# Altium schematic sheet IPC_V3S.SchDoc
size A1
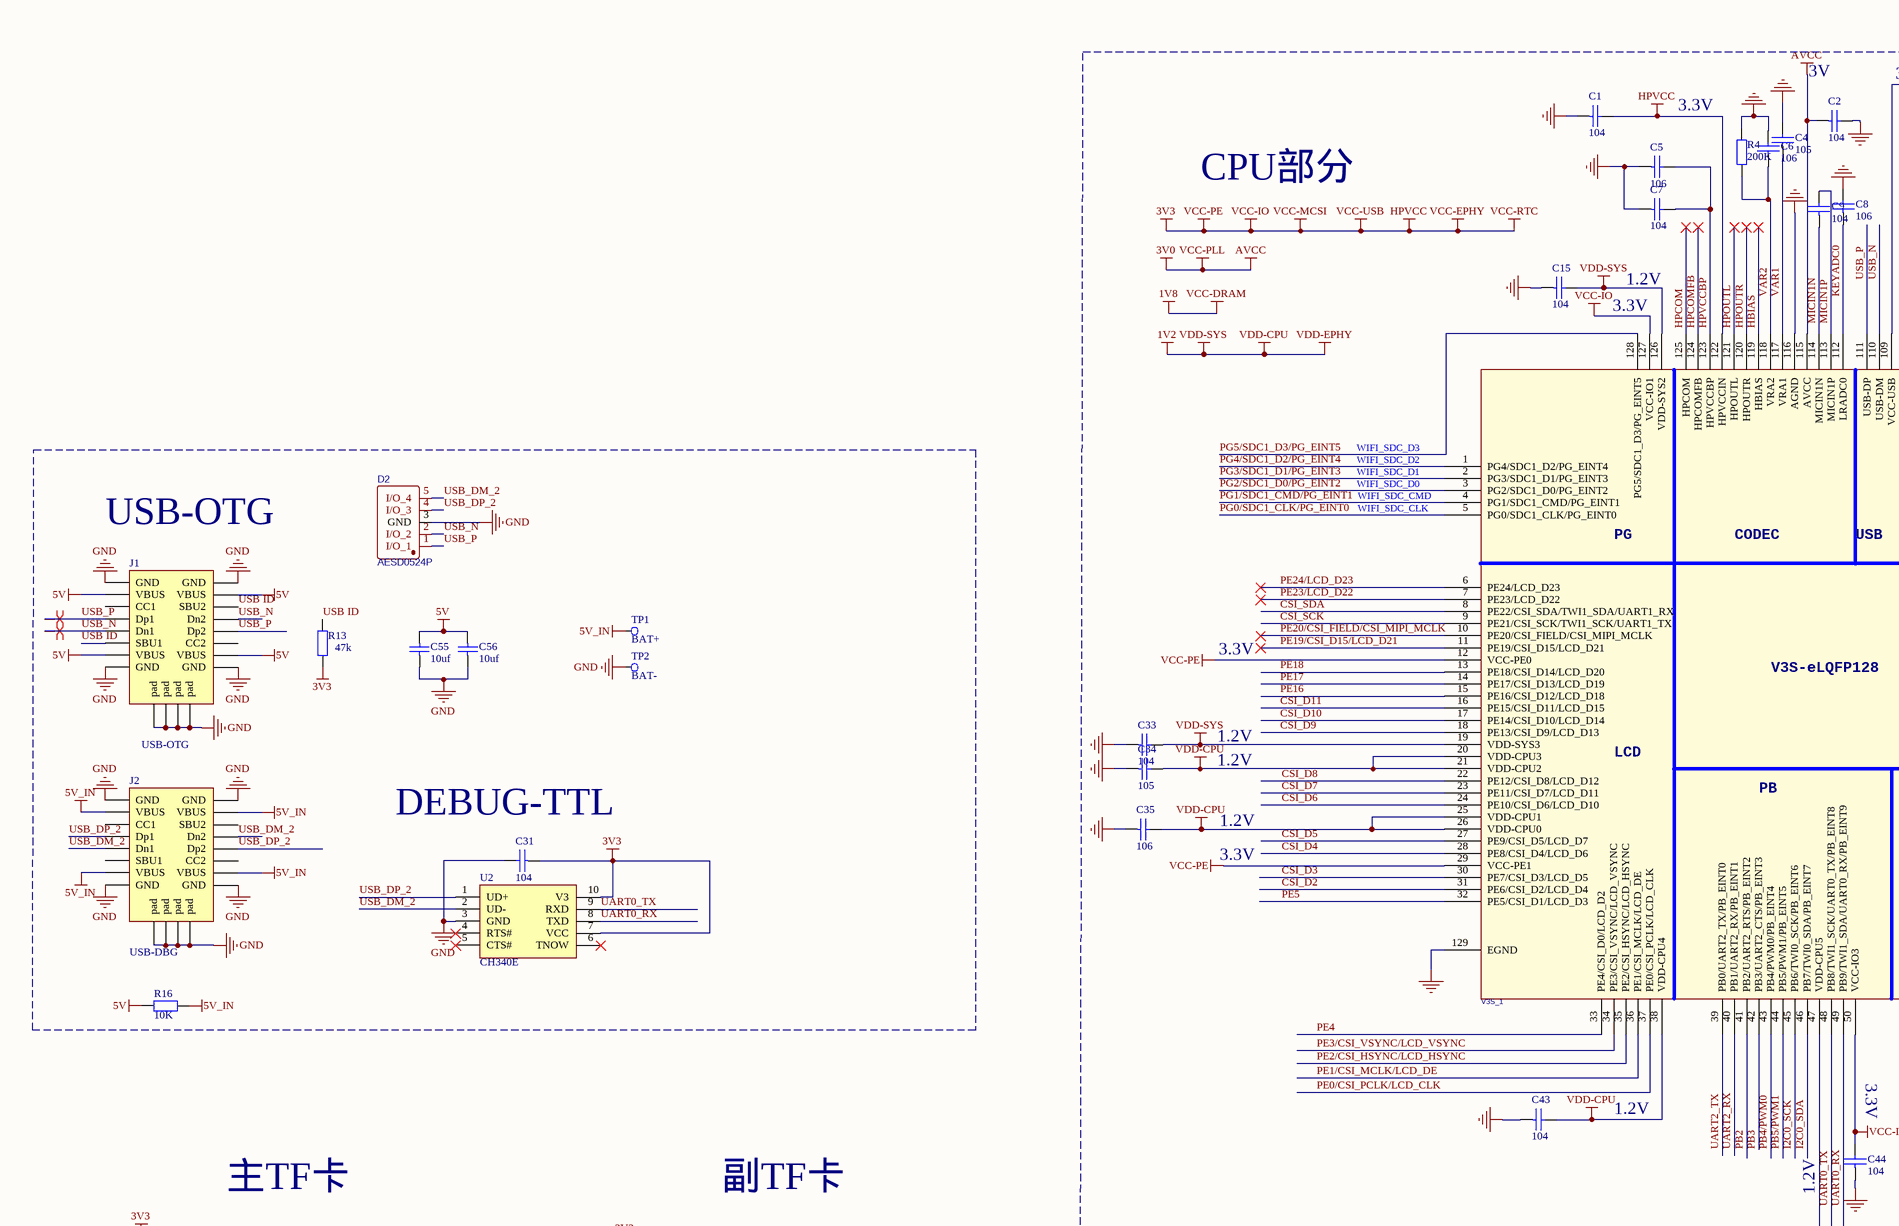
[diagram p0: IPC_V3S.SchDoc, top left]
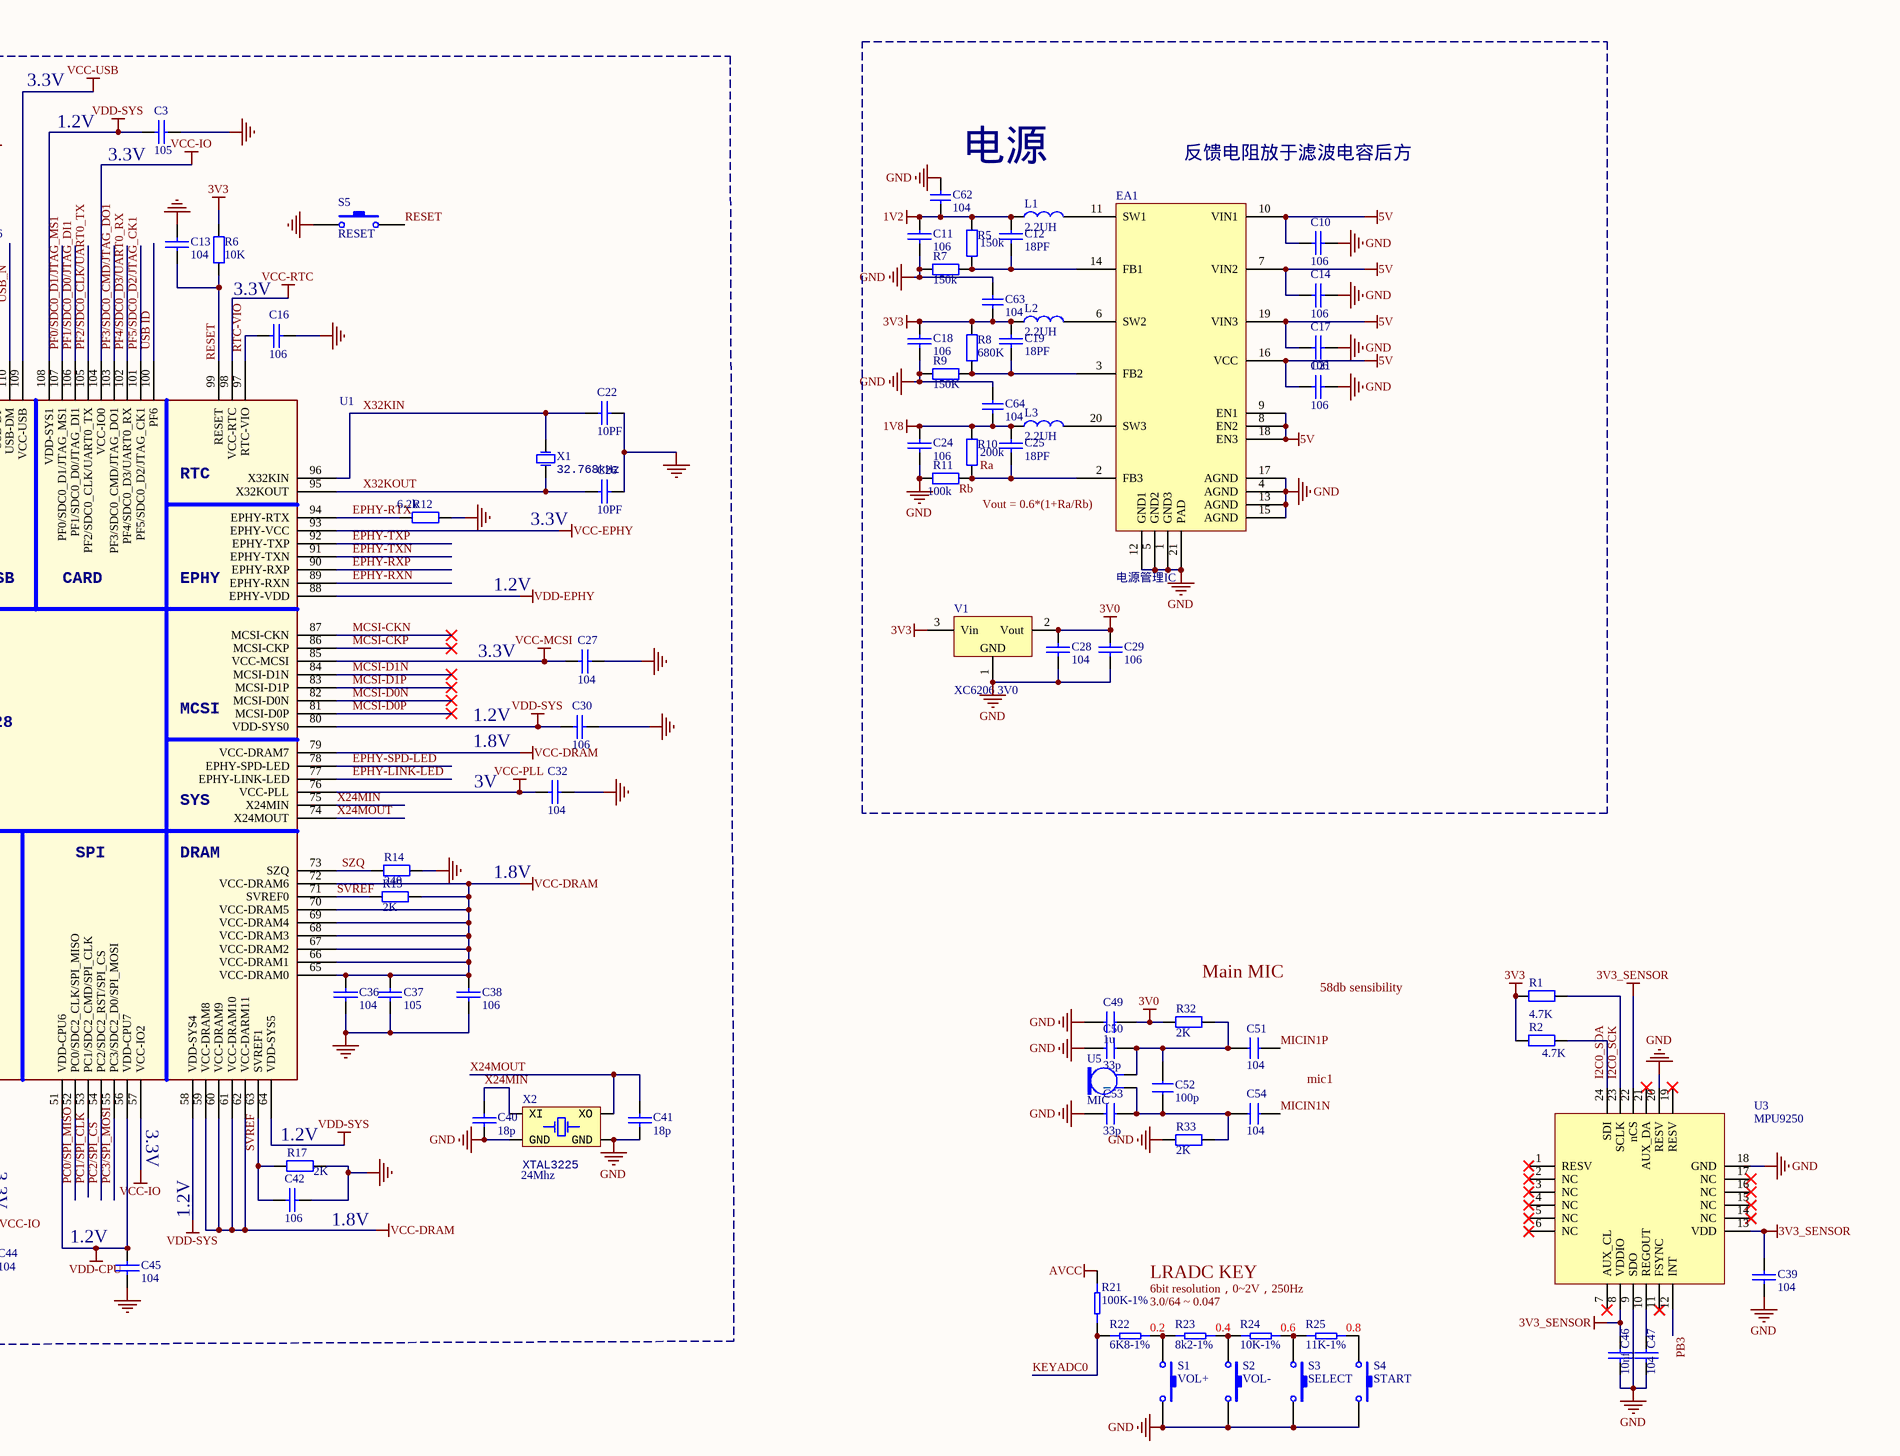
[diagram p1: IPC_V3S.SchDoc, top right]
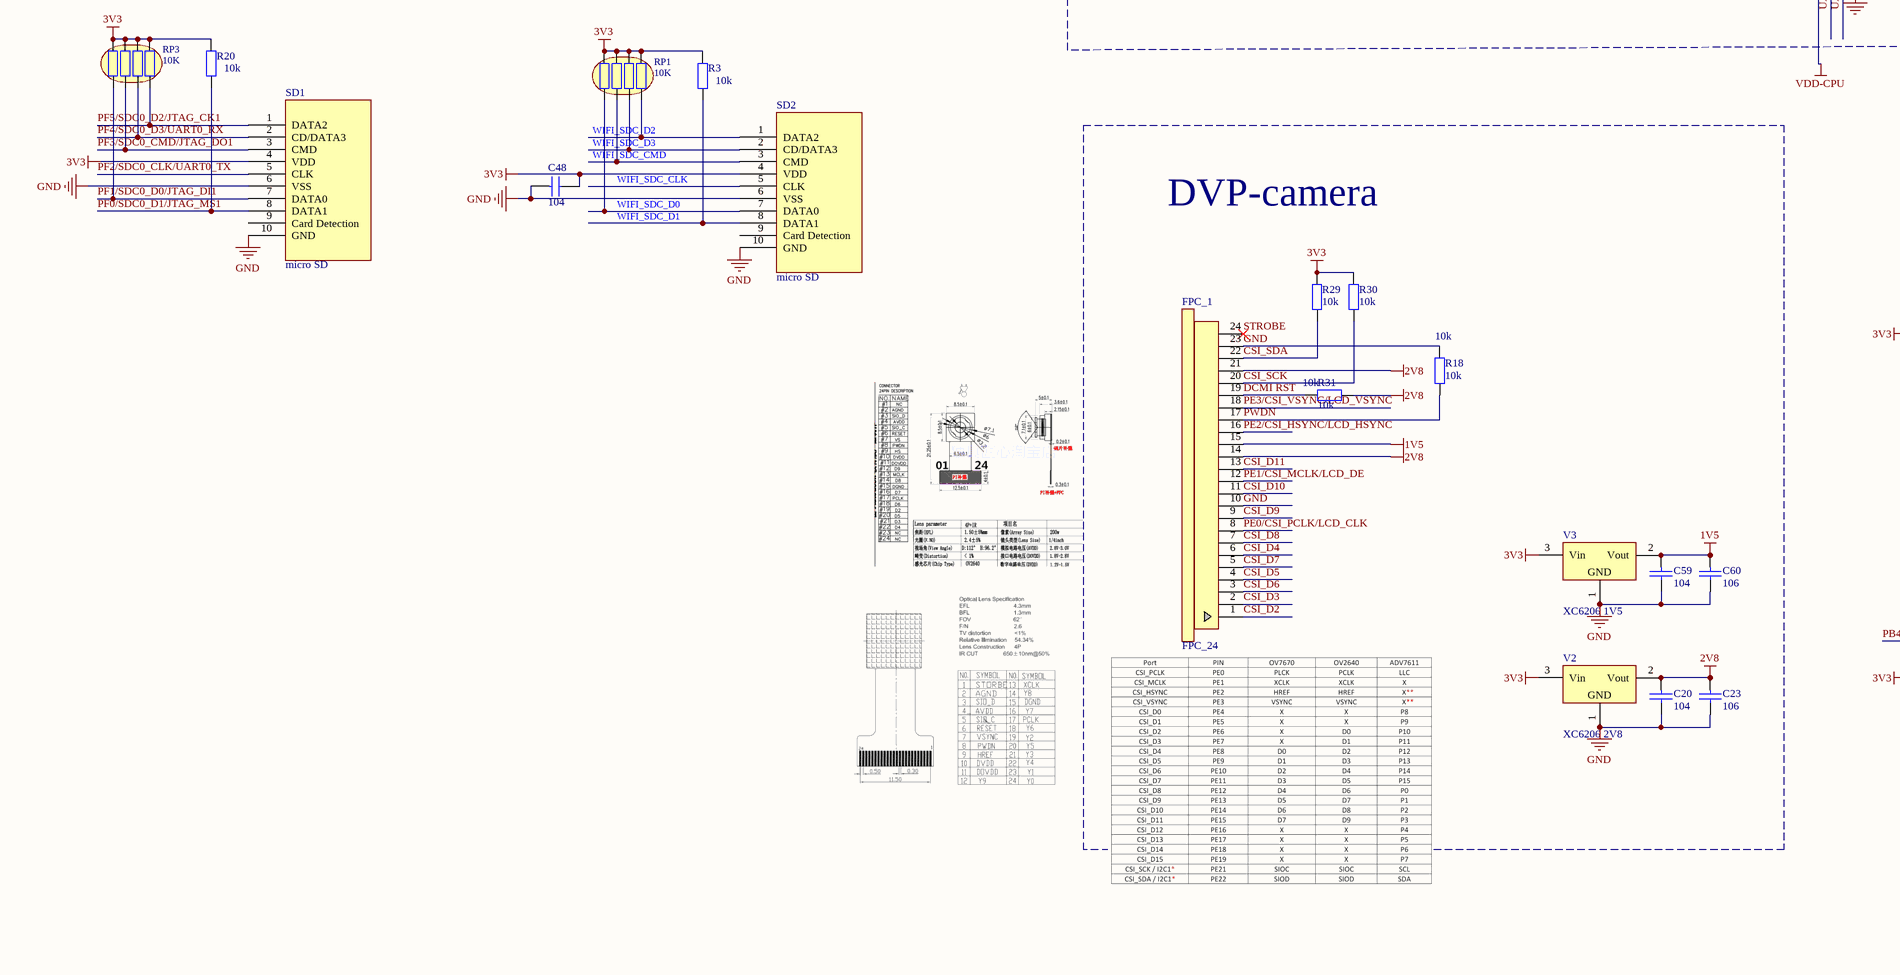
[diagram p2: IPC_V3S.SchDoc, bottom left]
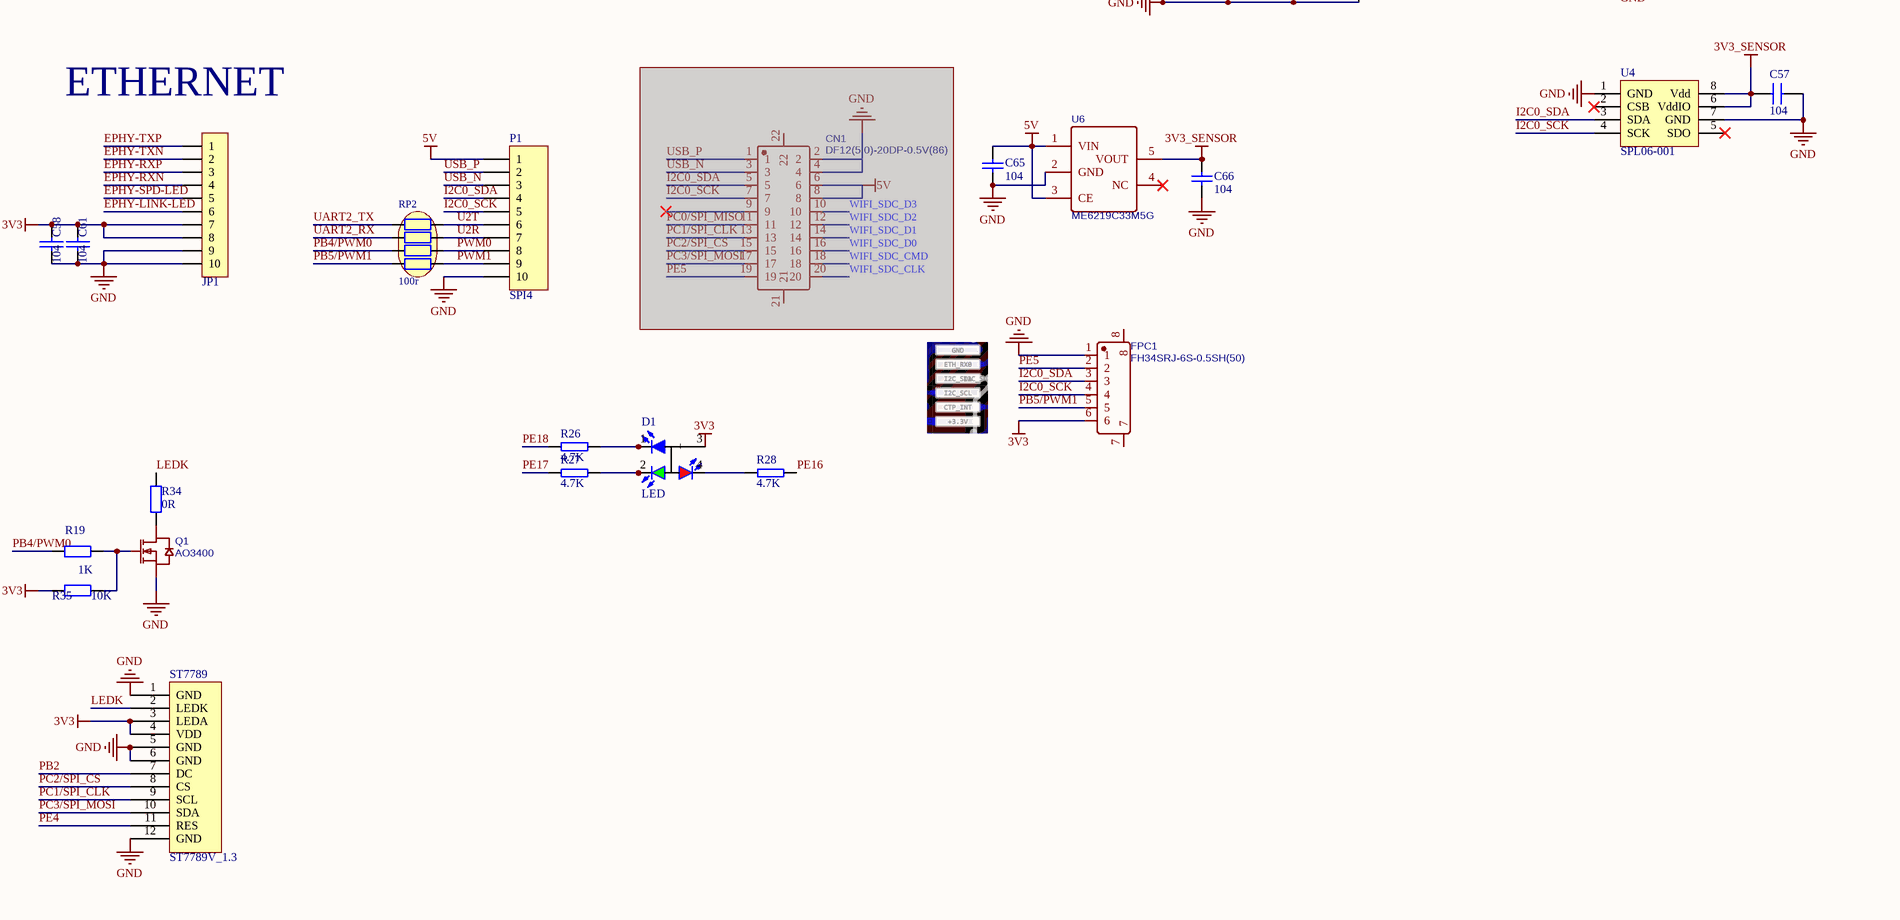
[diagram p3: IPC_V3S.SchDoc, bottom right]

## Parts
C1  104  [CAP_0402]
C2  104  [CAP_0402]
C3  105  [CAP_0402]
C4  105  [CAP_0402]
C5  106  [0603_C]
C6  106  [CAP_0402]
C7  104  [CAP_0402]
C8  106  [CAP_0402]
C9  104  [CAP_0402]
C10  106  [0805_C]
C11  106  [CAP_0402]
C12  18PF  [CAP_0402]
C13  104  [CAP_0402]
C14  106  [CAP_0402]
C15  104  [CAP_0402]
C16  106  [0805_C]
C17  106  [CAP_0402]
C18  106  [CAP_0402]
C19  18PF  [CAP_0402]
C20  104  [CAP_0402]
C21  106  [CAP_0402]
C22  10PF  [CAP_0402]
C23  106  [CAP_0402]
C24  106  [CAP_0402]
C25  18PF  [CAP_0402]
C26  10PF  [CAP_0402]
C27  104  [CAP_0402]
C28  104  [CAP_0402]
C29  106  [CAP_0402]
C30  106  [0603_C]
C31  104  [CAP_0402]
C32  104  [CAP_0402]
C33  104  [CAP_0402]
C34  105  [CAP_0402]
C35  106  [0603_C]
C36  104  [CAP_0402]
C37  105  [CAP_0402]
C38  106  [0603_C]
C39  104  [CAP_0402]
C40  18p  [CAP_0402]
C41  18p  [CAP_0402]
C42  106  [0603_C]
C43  104  [CAP_0402]
C44  104  [CAP_0402]
C45  104  [CAP_0402]
C46  10nf  [CAP_0402]
C47  104  [CAP_0402]
C48  104  [CAP_0402]
C49  1u  [CAP_0402]
C50  33p  [CAP_0402]
C51  104  [CAP_0402]
C52  100p  [CAP_0402]
C53  33p  [CAP_0402]
C54  104  [CAP_0402]
C55  10uf  [0805-C]
C56  10uf  [0805-C]
C57  104  [CAP_0402]
C58  104  [CAP_0402]
C59  104  [CAP_0402]
C60  106  [CAP_0402]
C61  104  [CAP_0402]
C62  104  [0603-C]
C63  104  [0603-C]
C64  104  [0603-C]
C65  104  [0603-C]
C66  104  [0603-C]
CN1  DF12(5.0)-20DP-0.5V(86)  [CONN-SMD_20P-P0.50_DF12-5.0-20DP-0.5V-86]  (masked out: inside a compile mask, not in the netlist)
D1  LED  [LED-ARRAY-SMD_HS-1204-RGB]
D2  AESD0524P  [RCLAMP0524 SEMTECH]
EA1  电源管理IC  [QFN20 3x3_M]
FPC1  FH34SRJ-6S-0.5SH(50)  [0.5mm*6p]
FPC_1  FPC_24  [FPC_24]
J1  USB-OTG  [USB Type-C-16Pin_A]
J2  USB-DBG  [USB Type-C-16Pin_A]
JP1  FPC1.0-10P  [FPC0.5 2H-WS-10P]  (value not drawn)
L1  2.2UH  [2520-L]
L2  2.2UH  [2520-L]
L3  2.2UH  [2520-L]
P1  SPI4  [SMD-1.25*10]
Q1  AO3400  [SOT23-3]
R1  4.7K  [RES_0402]
R2  4.7K  [RES_0402]
R3  10k  [RES_0402]
R4  200K  [RES_0402]
R5  value 150k  [RES_0402]  (hidden comment: 110K)
R6  10K  [RES_0402]
R7  value 150k  [RES_0402]  (hidden comment: 110K)
R8  680K  [RES_0402]
R9  150K  [RES_0402]
R10  200k  [RES_0402]
R11  100k  [RES_0402]
R12  6.2k  [RES_0402]
R13  47k  [RES_0402]
R14  value 240  [RES_0402]  (hidden comment: 240r)
R15  2k  [RES_0402]
R16  value 10K  [LC-0805_R]  (hidden comment: FUSE)
R17  2K  [RES_0402]
R18  10k  [RES_0402]
R19  1K  [RES_0402]
R20  10k  [RES_0402]
R21  100K-1%  [RES_0402]
R22  6K8-1%  [RES_0402]
R23  8k2-1%  [RES_0402]
R24  10K-1%  [RES_0402]
R25  11K-1%  [RES_0402]
R26  4.7K  [0402-R]
R27  4.7K  [0402-R]
R28  4.7K  [0402-R]
R29  10k  [RES_0402]
R30  10k  [RES_0402]
R31  10k  [RES_0402]
R32  2K  [RES_0402]
R33  2K  [RES_0402]
R34  0R  [RES_0402]
R35  10K  [RES_0402]
RP1  10K  [RCA-8P4R-0402]
RP2  100r  [RCA-8P4R-0402]
RP3  10K  [RCA-8P4R-0402]
S1  VOL+  [SW-SMD_TS-1086E-AC03526]
S2  VOL-  [SW-SMD_TS-1086E-AC03526]
S3  SELECT  [SW-SMD_TS-1086E-AC03526]
S4  START  [SW-SMD_TS-1086E-AC03526]
S5  RESET  [SW-SMD_TS-1086E-AC03526]
SD1  micro SD  [TF卡座 短体 molex47309-2851_MOL]
SD2  micro SD  [TF卡座 短体 molex47309-2851_MOL]
ST7789  ST7789V_1.3  [ST7789V_12Pin]
TP1  BAT+  [Test points]
TP2  BAT-  [Test points]
U1  V3S_1  [LQFP129 14x14_N]
U2  CH340E  [串口_MSOP10]
U3  MPU9250  [MPU9250]
U4  SPL06-001  [SPL06-001]
U5  MIC  [MIC-0416]
U6  ME6219C33M5G  [SOT23-5]
V1  XC6206 3V0  [SOT23-3N]
V2  XC6206 2V8  [SOT23-3N]
V3  XC6206 1V5  [SOT23-3N]
X1  value 32.768kHz  [XT_3215_2]  (hidden comment: 32.768K)
X2  24Mhz  Type: XTAL3225  [XT_3225_4]

## Blocks framed on the sheet
CPU部分: C1-C9 C13 C15 C16 C22 C26 C27 C30 C32-C38 C40-C45 R4 R6 R12 R14 R15 R17 S5 U1 X1 X2
电源: C10-C12 C14 C17-C19 C21 C24 C25 C28 C29 C62-C64 EA1 L1-L3 R5 R7-R11 V1
DVP-camera: C20 C23 C59 C60 FPC_1 R18 R29-R31 V2 V3

## Nets
1V2: C3.1 C11.2 C12.1 C15.2 C30.1 C33.2 C34.2 C35.2 C43.2 C45.2 C62.1 L1.2 R5.2 U1.19(VDD-SYS3) U1.20(VDD-CPU3) U1.21(VDD-CPU2) U1.25(VDD-CPU1) U1.26(VDD-CPU0) U1.38(VDD-CPU4) U1.47(VDD-CPU5) U1.51(VDD-CPU6) U1.56(VDD-CPU7) U1.58(VDD-SYS4) U1.64(VDD-SYS5) U1.80(VDD-SYS0) U1.88(EPHY-VDD) U1.108(VDD-SYS1) U1.126(VDD-SYS2)  [also labelled VDD-CPU, VDD-EPHY, VDD-SYS]
1V5: C59.1 C60.1 FPC_1.15 V3.2(Vout)
1V8: C24.2 C25.1 C36.2 C37.2 C38.2 C64.1 L3.2 R10.2 R15.1 U1.59(VCC-DRAM8) U1.60(VCC-DRAM9) U1.61(VCC-DRAM10) U1.62(VCC-DARM11) U1.65(VCC-DRAM0) U1.66(VCC-DRAM1) U1.67(VCC-DRAM2) U1.68(VCC-DRAM3) U1.69(VCC-DRAM4) U1.70(VCC-DRAM5) U1.72(VCC-DRAM6) U1.79(VCC-DRAM7)  [also labelled VCC-DRAM]
2V8: C20.1 C23.1 FPC_1.14 FPC_1.21 R31.1 V2.2(Vout)
3V0: C2.1 C28.1 C29.1 C32.1 C49.1 R21.1 R32.2 U1.76(VCC-PLL) U1.115(AVCC) V1.2(Vout)  [also labelled AVCC, VCC-PLL]
3V3: C1.2 C18.2 C19.1 C27.1 C31.1 C44.2 C48.2 C58.2 C61.2 C63.1 D1.3(+) FPC1.6 JP1.7 JP1.8 L2.2 R1.2 R2.2 R3.1 R6.2 R8.2 R13.1 R20.1 R29.2 R30.2 R35.2 RP1.1 RP1.2 RP1.3 RP1.4 RP3.1 RP3.2 RP3.3 RP3.4 SD1.4(VDD) SD2.4(VDD) ST7789.3(LEDA) ST7789.4(VDD) U1.12(VCC-PE0) U1.29(VCC-PE1) U1.50(VCC-IO3) U1.57(VCC-IO2) U1.85(VCC-MCSI) U1.93(EPHY-VCC) U1.98(VCC-RTC) U1.104(VCC-IO0) U1.109(VCC-USB) U1.122(HPVCCIN) U1.127(VCC-IO1) U2.7(VCC) U2.10(V3) V1.3(Vin) V2.3(Vin) V3.3(Vin)  [also labelled HPVCC, VCC-EPHY, VCC-IO, VCC-MCSI, VCC-PE, VCC-RTC, VCC-USB]
3V3_SENSOR: C39.2 C46.2 C57.1 C66.2 U3.8(VDDIO) U3.13(VDD) U3.22(nCS) U4.6(VddIO) U4.8(Vdd) U6.5(VOUT)
5V: C10.1 C14.1 C17.1 C21.1 C55.2 C56.2 C65.2 EA1.7(VIN2) EA1.8(EN2) EA1.9(EN1) EA1.10(VIN1) EA1.16(VCC) EA1.18(EN3) EA1.19(VIN3) J1.A4(VBUS) J1.A9(VBUS) J1.B4(VBUS) J1.B9(VBUS) P1.1 R16.1 U6.1(VIN) U6.3(CE)
5V_IN: J2.A4(VBUS) J2.A9(VBUS) J2.B4(VBUS) J2.B9(VBUS) R16.2 TP1.1
GND: C1.1 C2.2 C3.2 C4.2 C5.1 C6.2 C7.1 C8.2 C10.2 C11.1 C13.2 C14.2 C15.1 C16.2 C17.2 C18.1 C20.2 C21.2 C22.2 C23.2 C24.1 C26.2 C27.2 C28.2 C29.2 C30.2 C31.2 C32.2 C33.1 C34.1 C35.1 C36.1 C37.1 C38.1 C39.1 C40.2 C41.2 C42.2 C43.1 C44.1 C45.1 C46.1 C47.1 C48.1 C49.2 C50.1 C53.1 C55.1 C56.1 C57.2 C58.1 C59.2 C60.2 C61.1 C62.2 C63.2 C64.2 C65.1 C66.1 D2.3(GND) EA1.1(GND3) EA1.4(AGND) EA1.5(GND2) EA1.12(GND1) EA1.13(AGND) EA1.15(AGND) EA1.17(AGND) EA1.21(PAD) FPC1.1 FPC_1.10 FPC_1.23 J1.0(pad) J1.A1(GND) J1.A12(GND) J1.B1(GND) J1.B12(GND) J2.0(pad) J2.A1(GND) J2.A12(GND) J2.B1(GND) J2.B12(GND) JP1.9 JP1.10 P1.10 Q1.2(S) R4.2 R7.1 R9.1 R11.1 R12.1 R14.1 R17.1 R18.2 R33.2 S1.1 S2.1 S3.1 S4.1 S5.2 SD1.6(VSS) SD1.10(GND) SD2.6(VSS) SD2.10(GND) ST7789.1(GND) ST7789.5(GND) ST7789.6(GND) ST7789.12(GND) TP2.1 U1.116(AGND) U1.129(EGND) U2.3(GND) U3.9(SDO) U3.18(GND) U3.20(RESV) U4.1(GND) U4.7(GND) U6.2(GND) V1.1(GND) V2.1(GND) V3.1(GND) X2.2(GND) X2.4(GND)
CSI_D2: FPC_1.1 U1.31(PE6/CSI_D2/LCD_D4)
CSI_D3: FPC_1.2 U1.30(PE7/CSI_D3/LCD_D5)
CSI_D4: FPC_1.6 U1.28(PE8/CSI_D4/LCD_D6)
CSI_D5: FPC_1.4 U1.27(PE9/CSI_D5/LCD_D7)
CSI_D6: FPC_1.3 U1.24(PE10/CSI_D6/LCD_D10)
CSI_D7: FPC_1.5 U1.23(PE11/CSI_D7/LCD_D11)
CSI_D8: FPC_1.7 U1.22(PE12/CSI_D8/LCD_D12)
CSI_D9: FPC_1.9 U1.18(PE13/CSI_D9/LCD_D13)
CSI_D10: FPC_1.11 U1.17(PE14/CSI_D10/LCD_D14)
CSI_D11: FPC_1.13 U1.16(PE15/CSI_D11/LCD_D15)
CSI_SCK: FPC_1.20 R30.1 U1.9(PE21/CSI_SCK/TWI1_SCK/UART1_TX)
CSI_SDA: FPC_1.22 R29.1 U1.8(PE22/CSI_SDA/TWI1_SDA/UART1_RX)
DCMI RST: FPC_1.19 R31.2
EPHY-LINK-LED: JP1.6 U1.77(EPHY-LINK-LED)
EPHY-RTX: R12.2 U1.94(EPHY-RTX)
EPHY-RXN: JP1.4 U1.89(EPHY-RXN)
EPHY-RXP: JP1.3 U1.90(EPHY-RXP)
EPHY-SPD-LED: JP1.5 U1.78(EPHY-SPD-LED)
EPHY-TXN: JP1.2 U1.91(EPHY-TXN)
EPHY-TXP: JP1.1 U1.92(EPHY-TXP)
HBIAS: U1.119(HBIAS)
HPCOM: U1.125(HPCOM)
HPCOMFB: U1.124(HPCOMFB)
HPOUTL: U1.121(HPOUTL)
HPOUTR: U1.120(HPOUTR)
HPVCCBP: C5.2 C7.2 U1.123(HPVCCBP)
I2C0_SCK: FPC1.4 P1.5 R1.1 U1.45(PB6/TWI0_SCK/PB_EINT6) U3.23(SCLK) U4.4(SCK)
I2C0_SDA: FPC1.3 P1.4 R2.1 U1.46(PB7/TWI0_SDA/PB_EINT7) U3.24(SDI) U4.3(SDA)
KEYADC0: C8.1 R21.2 R22.2 U1.112(LRADC0)
LEDK: R34.1 ST7789.2(LEDK)
MCSI-CKN: U1.87(MCSI-CKN)
MCSI-CKP: U1.86(MCSI-CKP)
MCSI-D0N: U1.82(MCSI-D0N)
MCSI-D0P: U1.81(MCSI-D0P)
MCSI-D1N: U1.84(MCSI-D1N)
MCSI-D1P: U1.83(MCSI-D1P)
MICIN1N: C9.1 C54.2 U1.114(MICIN1N)
MICIN1P: C9.2 C51.2 U1.113(MICIN1P)
PB2: ST7789.7(DC) U1.41(PB2/UART2_RTS/PB_EINT2)
PB3: U1.42(PB3/UART2_CTS/PB_EINT3) U3.12(INT)
PB4/PWM0: R19.2 RP2.3 U1.43(PB4/PWM0/PB_EINT4)
PB5/PWM1: FPC1.5 RP2.4 U1.44(PB5/PWM1/PB_EINT5)
PC0/SPI_MISO: U1.52(PC0/SDC2_CLK/SPI_MISO)
PC1/SPI_CLK: ST7789.9(SCL) U1.53(PC1/SDC2_CMD/SPI_CLK)
PC2/SPI_CS: ST7789.8(CS) U1.54(PC2/SDC2_RST/SPI_CS)
PC3/SPI_MOSI: ST7789.10(SDA) U1.55(PC3/SDC2_D0/SPI_MOSI)
PE0/CSI_PCLK/LCD_CLK: FPC_1.8 U1.37(PE0/CSI_PCLK/LCD_CLK)
PE1/CSI_MCLK/LCD_DE: FPC_1.12 U1.36(PE1/CSI_MCLK/LCD_DE)
PE2/CSI_HSYNC/LCD_HSYNC: FPC_1.16 U1.35(PE2/CSI_HSYNC/LCD_HSYNC)
PE3/CSI_VSYNC/LCD_VSYNC: FPC_1.18 U1.34(PE3/CSI_VSYNC/LCD_VSYNC)
PE4: ST7789.11(RES) U1.33(PE4/CSI_D0/LCD_D2)
PE5: FPC1.2 U1.32(PE5/CSI_D1/LCD_D3)
PE16: R28.2 U1.15(PE16/CSI_D12/LCD_D18)
PE17: R27.1 U1.14(PE17/CSI_D13/LCD_D19)
PE18: R26.1 U1.13(PE18/CSI_D14/LCD_D20)
PE19/CSI_D15/LCD_D21: U1.11(PE19/CSI_D15/LCD_D21)
PE20/CSI_FIELD/CSI_MIPI_MCLK: U1.10(PE20/CSI_FIELD/CSI_MIPI_MCLK)
PE23/LCD_D22: U1.7(PE23/LCD_D22)
PE24/LCD_D23: U1.6(PE24/LCD_D23)
PF0/SDC0_D1/JTAG_MS1: R20.2 SD1.8(DATA1) U1.107(PF0/SDC0_D1/JTAG_MS1)
PF1/SDC0_D0/JTAG_DI1: RP3.5 SD1.7(DATA0) U1.106(PF1/SDC0_D0/JTAG_DI1)
PF2/SDC0_CLK/UART0_TX: SD1.5(CLK) U1.105(PF2/SDC0_CLK/UART0_TX)
PF3/SDC0_CMD/JTAG_DO1: RP3.6 SD1.3(CMD) U1.103(PF3/SDC0_CMD/JTAG_DO1)
PF4/SDC0_D3/UART0_RX: RP3.7 SD1.2(CD/DATA3) U1.102(PF4/SDC0_D3/UART0_RX)
PF5/SDC0_D2/JTAG_CK1: RP3.8 SD1.1(DATA2) U1.101(PF5/SDC0_D2/JTAG_CK1)
PG0/SDC1_CLK/PG_EINT0: SD2.5(CLK) U1.5(PG0/SDC1_CLK/PG_EINT0)  [also labelled WIFI_SDC_CLK]
PG1/SDC1_CMD/PG_EINT1: RP1.6 SD2.3(CMD) U1.4(PG1/SDC1_CMD/PG_EINT1)  [also labelled WIFI_SDC_CMD]
PG2/SDC1_D0/PG_EINT2: RP1.5 SD2.7(DATA0) U1.3(PG2/SDC1_D0/PG_EINT2)  [also labelled WIFI_SDC_D0]
PG3/SDC1_D1/PG_EINT3: R3.2 SD2.8(DATA1) U1.2(PG3/SDC1_D1/PG_EINT3)  [also labelled WIFI_SDC_D1]
PG4/SDC1_D2/PG_EINT4: RP1.8 SD2.1(DATA2) U1.1(PG4/SDC1_D2/PG_EINT4)  [also labelled WIFI_SDC_D2]
PG5/SDC1_D3/PG_EINT5: RP1.7 SD2.2(CD/DATA3) U1.128(PG5/SDC1_D3/PG_EINT5)  [also labelled WIFI_SDC_D3]
PWDN: FPC_1.17 R18.1
PWM0: P1.8 RP2.6
PWM1: P1.9 RP2.5
RESET: C13.1 R6.1 S5.1 U1.99(RESET)
RTC-VIO: C16.1 U1.97(RTC-VIO)
STROBE: FPC_1.24
SVREF: C42.1 R15.2 R17.2 U1.63(SVREF1) U1.71(SVREF0)
SZQ: R14.2 U1.73(SZQ)
U2R: P1.7 RP2.7
U2T: P1.6 RP2.8
UART0_RX: U1.49(PB9/TWI1_SDA/UART0_RX/PB_EINT9) U2.8(TXD)
UART0_TX: U1.48(PB8/TWI1_SCK/UART0_TX/PB_EINT8) U2.9(RXD)
UART2_RX: RP2.2 U1.40(PB1/UART2_RX/PB_EINT1)
UART2_TX: RP2.1 U1.39(PB0/UART2_TX/PB_EINT0)
USB ID: J1.A8(SBU1) J1.B8(SBU2) R13.2 U1.100(PF6)
USB_DM_2: D2.5(I/O_4) J2.A7(Dn1) J2.B7(Dn2) U2.2(UD-)
USB_DP_2: D2.4(I/O_3) J2.A6(Dp1) J2.B6(Dp2) U2.1(UD+)
USB_N: D2.2(I/O_2) J1.A7(Dn1) J1.B7(Dn2) P1.3 U1.110(USB-DM)
USB_P: D2.1(I/O_1) J1.A6(Dp1) J1.B6(Dp2) P1.2 U1.111(USB-DP)
VAR1: C4.1 U1.117(VRA1)
VAR2: C6.1 R4.1 U1.118(VRA2)
X24MIN: C40.1 U1.75(X24MIN) X2.1(XI)
X24MOUT: C41.1 U1.74(X24MOUT) X2.3(XO)
X32KIN: C22.1 U1.96(X32KIN) X1.2(OSC2)
X32KOUT: C26.1 U1.95(X32KOUT) X1.1(OSC1)
NetC12_2: C12.2 EA1.14(FB1) R5.1 R7.2
NetC19_2: C19.2 EA1.3(FB2) R8.1 R9.2
NetC25_2: C25.2 EA1.2(FB3) R10.1 R11.2
NetC47_2: C47.2 U3.10(REGOUT)
NetC50_2: C50.2 C51.1 C52.1 R32.1 U5.2
NetC52_2: C52.2 C53.2 C54.1 R33.1 U5.1
NetD1_1: D1.1(b) R26.2
NetD1_2: D1.2(g) R27.2
NetD1_4: D1.4(r) R28.1
NetEA1_6: EA1.6(SW2) L2.1
NetEA1_11: EA1.11(SW1) L1.1
NetEA1_20: EA1.20(SW3) L3.1
NetQ1_1: Q1.1(G) R19.1 R35.1
NetQ1_3: Q1.3(D) R34.2
NetR22_1: R22.1 R23.2 S1.2
NetR23_1: R23.1 R24.2 S2.2
NetR24_1: R24.1 R25.2 S3.2
NetR25_1: R25.1 S4.2

Not connected (* = marked no-connect by the designer): FPC1 7 8; J1 A5(CC1) B5(CC2); J2 A5(CC1) A8(SBU1) B5(CC2) B8(SBU2); SD1 9(Card_Detection); SD2 9(Card_Detection); U2 4(RTS#)* 5(CTS#)* 6(TNOW)*; U3 1(RESV)* 2(NC)* 3(NC)* 4(NC)* 5(NC)* 6(NC)* 7(AUX_CL)* 11(FSYNC)* 14(NC)* 15(NC)* 16(NC)* 17(NC)* 19(RESV)* 21(AUX_DA)*; U4 2(CSB)* 5(SDO)*; U6 4(NC)*

## Layout directives
differential pair; net class *: USB_P
differential pair: USB_N

## Notes on the sheet
- 3.3V
- 3V
- 1.2V
- (near C3) 3.3V
- 反馈电阻放于滤波电容后方
- USB-OTG
- 1.8V
- (near C31) DEBUG-TTL
- Main MIC
- (near R32) 58db sensibility
- (near U1) 3.3V
- mic1
- (near C44) 3.3V
- (near R17) 1.2V
- (near C45) 1.2V
- 主TF卡
- 副TF卡
- (near C44) 1.2V
- 6bit resolution，0~2V，250Hz
- LRADC KEY
- 3.0/64 ~ 0.047
- (near R22) 0.2
- (near R23) 0.4
- (near R24) 0.6
- (near R25) 0.8
- (near JP1) ETHERNET
- Labels drawn without touching a wire or pin: Ra, Rb, Vout = 0.6*(1+Ra/Rb)
- (in symbol V3S_1) RTC; PG; CODEC; USB; CARD; EPHY; MCSI; V3S-eLQFP128; SYS; LCD; PB; SPI; DRAM

## Library data of the parts
C1-C47 C58-C61 = CAP
C48-C54 C57 = CAP: SMD-CAP
C55 C56 = Cap_1: 0805; Value: 1nF; Published: 8-Jun-2000; Revision: July-2002: Re-released for DXP Platform.; Publisher: Altium Limited
C62-C66 = CAP: 贴片电容
CN1 = DF12(5.0)-20DP-0.5V(86): BOM_Manufacturer: HRS(Hirose); Contributor: LCSC; BOM_Supplier: LCSC; BOM_Supplier Part: C506671; BOM_Manufacturer Part: DF12(5.0)-20DP-0.5V(86); BOM_JLCPCB Part Class: Extended Part; spicePre: C; spiceSymbolName: DF12(5.0)-20DP-0.5V(86)
D1 = RGB_SIDE: 卧贴RGB
D2 = AESD0524P: BOM_Manufacturer: AnBon; Contributor: LCSC; BOM_Supplier: LCSC; BOM_Supplier Part: C397789; BOM_Manufacturer Part: AESD0524P; spicePre: D; spiceSymbolName: AESD0524P
EA1 = EA3036
FPC1 = FH34SRJ-6S-0.5SH(50): BOM_Manufacturer: Hirose; Contributor: LCSC; BOM_Supplier: LCSC; BOM_Supplier Part: C224194; BOM_Manufacturer Part: FH34SRJ-6S-0.5SH(50); BOM_JLCPCB Part Class: Extended Part; spicePre: F; spiceSymbolName: FH34SRJ-6S-0.5SH(50)
J1 J2 = USB_C
JP1 = FPC_10P: FPC连接器; 版权归属: 源创客; BOM名称: FPC连接器; 学习资源: www.ooocke.com
L1-L3 = L1: 电感
P1 = Header 10: Header, 10-Pin; LatestRevisionDate: 17-Jul-2002; LatestRevisionNote: Re-released for DXP Platform.; Publisher: Altium Limited
Q1 = AO3400MI-MS: BOM_Manufacturer: MSKSEMI(美森科); Contributor: LCSC; BOM_Supplier: LCSC; BOM_Supplier Part: C2847030; BOM_Manufacturer Part: AO3400MI-MS; spicePre: Q; spiceSymbolName: AO3400MI-MS
R1-R20 R29-R35 = Res2: Resistor; Published: 8-Jun-2000; LatestRevisionDate: 17-Jul-2002; LatestRevisionNote: Re-released for DXP Platform.; PackageReference: AXIAL-0.4; Publisher: Altium Limited
  R4: Value: 200K
  R6: Value: 10K
  R8: Value: 680K
  R9: Value: 150K
  R15 R32 R33: Value: 2K
  R18 R29-R31: Value: 10k
R21-R25 = R
R26-R28 = RES: 贴片电阻
RP1-RP3 = 224: BOM名称: 贴片网络排阻; 版权归属: 源创客; 学习资源: www.ooocke.com
S1-S5 = SW-PB: Switch; Published: 24-Mar-1999; LatestRevisionDate: 17-Jul-2002; LatestRevisionNote: Re-released for DXP Platform.; PackageReference: SPST-2; Publisher: Altium Limited
TP1 TP2 = TESTPOINT
U2 = CH340E: _Comma: ,; _Footprint: MSOP10; _Name: USB-UART; _Specification: USB-UART,CH340E,MSOP10; _Model: CH340E
U3 = MPU9250: Sensor
U6 = ME6219C33M5G: BOM_Manufacturer: MICRONE; SMT Type: Extend; BOM_Supplier: LCSC; BOM_Manufacturer Part: ME6219C33M5G; image: //image.lceda.cn/szlcsc/C47382.jpg; BOM_Supplier Part: C47382; BOM_LCSC Assembly: Yes; spicePre: U; spiceSymbolName: ME6219C33M5G
V1-V3 = XC6206P332MR: 低压差线性稳压芯片; 版权归属: 源创客; BOM名称: 低压差线性稳压芯片; 学习资源: www.ooocke.com
X1 = XTAL_32.768k: Crystal Oscillator
X2 = XTAL_3225_4P: Crystal Oscillator